# Altium schematic sheet GPS - ML8088s.SchDoc
size A4
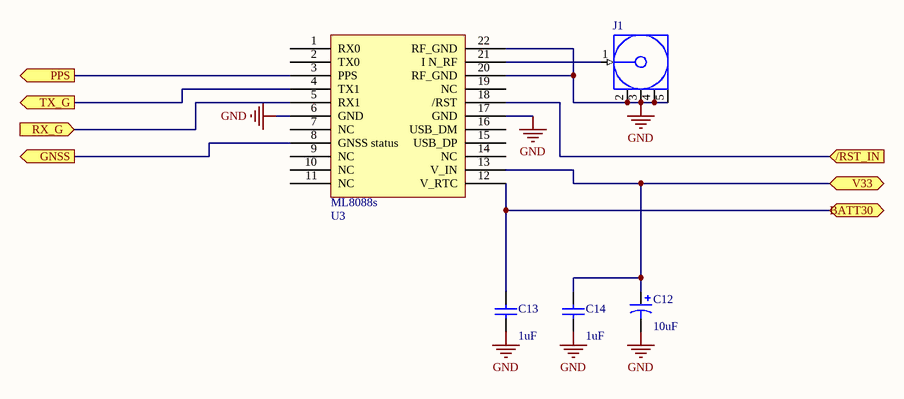
[diagram p0: GPS - ML8088s.SchDoc]

## Parts
C12  value 10uF  [R38]  (hidden comment: Cap Pol1)
C13  value 1uF  [RAD-0.1]  (hidden comment: Cap)
C14  value 1uF  [RAD-0.1]  (hidden comment: Cap)
J1  COAX-F  [MCX5.08-H5]  (value not drawn)
U3  Component_1  [LCCS127P1300X1500X280-22M]  (value not drawn)

## Ports
/RST_IN (in), BATT30 (bidir), GNSS (out), PPS (out), RX_G (in), TX_G (out), V33 (bidir)

## Nets
GND: C12.2 C13.1 C14.1 J1.2(GND) J1.3(GND) J1.4(GND) J1.5(GND) U3.6(GND) U3.17(GND) U3.20(RF_GND) U3.22(RF_GND)
/RST_IN: U3.18(/RST) ; port /RST_IN
BATT30: C13.2 U3.12(V_RTC) ; port BATT30
GNSS: U3.8(GNSS_status) ; port GNSS
PPS: U3.3(PPS) ; port PPS
RX_G: U3.5(RX1) ; port RX_G
TX_G: U3.4(TX1) ; port TX_G
V33: C12.1 C14.2 U3.13(V_IN) ; port V33
NetJ1_1: J1.1(Signal) U3.21(I_N_RF)

Not connected (* = marked no-connect by the designer): U3 1(RX0) 2(TX0) 7(NC) 9(NC) 10(NC) 11(NC) 14(NC) 15(USB_DP) 16(USB_DM) 19(NC)

## Notes on the sheet
- (in symbol Component_1) ML8088s

## Library data of the parts
C12 = Cap Pol1: Polarized Capacitor (Radial); Published: 8-Jun-2000; LatestRevisionDate: 17-Jul-2002; LatestRevisionNote: Re-released for DXP Platform.; PackageReference: RB7.6-15; Publisher: Altium Limited; PackageDescription: Polarized Capacitor (Radial); 2 Leads
C13 C14 = Cap: Capacitor; Published: 8-Jun-2000; LatestRevisionDate: 17-Jul-2002; LatestRevisionNote: Re-released for DXP Platform.; PackageReference: RAD-0.3; Publisher: Altium Limited; PackageDescription: Radial Cap, Thru-Hole; 2 Leads; 0.3 in Pin Spacing
J1 = COAX-F: RF Coaxial PCB Connector, MCX; Thru-Hole, Right-Angle Mount Socket, Blunt Post Terminal, 50 Ohm Impedance; PCB_Layout: Complies with manufacturer's recommendation.; DrillSize: Corresponds to nominal value.; Published: 15-Jul-2004; LatestRevisionDate: 15-Jul-2004; LatestRevisionNote: Component Replaced.; DatasheetDocument: 30-May-2003; PackageDocument: 04-Jul-1999; PackageReference: 919-119J-51AX; Publisher: Altium Limited; ComponentLink1Description: Manufacturer Link; ComponentLink1URL: http://www.amphenolrf.com/